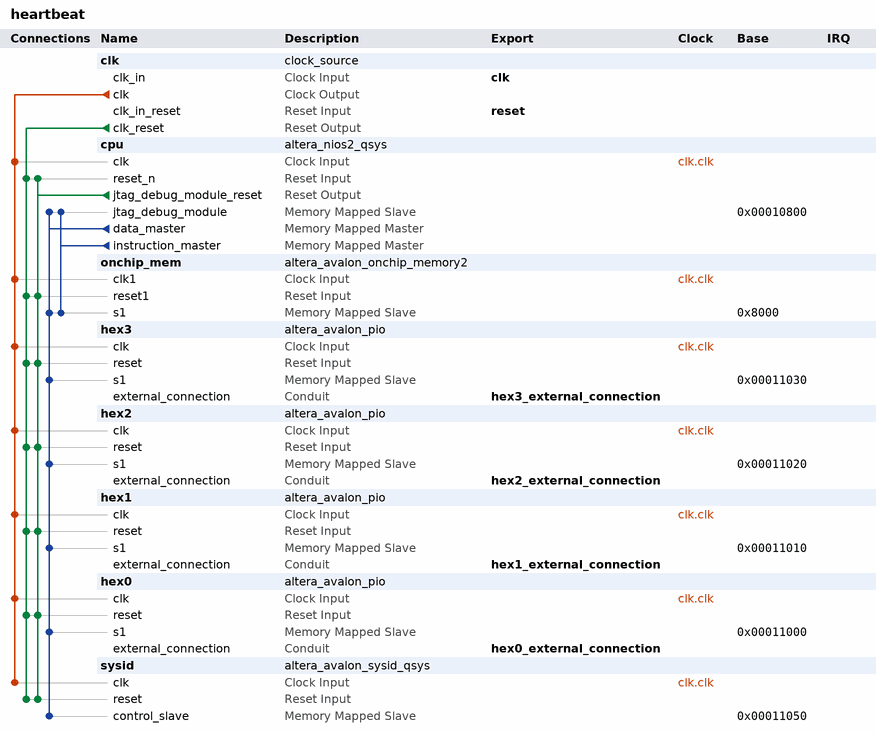
[diagram p0: system contents]
# Platform Designer (Qsys) system heartbeat, Cyclone II EP2C20F484C7
# Parameters at their usual value, and those the tool derives, are not listed.
package require -exact qsys 13.0.1.99.2
create_system heartbeat
set_project_property DEVICE_FAMILY {Cyclone II}
set_project_property DEVICE EP2C20F484C7

add_instance clk clock_source 13.0
set_instance_parameter_value clk clockFrequency 50000000

add_instance cpu altera_nios2_qsys 13.0
set_instance_parameter_value cpu resetSlave onchip_mem.s1
set_instance_parameter_value cpu mmu_TLBMissExcSlave None
set_instance_parameter_value cpu exceptionSlave onchip_mem.s1
set_instance_parameter_value cpu breakSlave cpu.jtag_debug_module
set_instance_parameter_value cpu impl Tiny
set_instance_parameter_value cpu icache_size 4096

add_instance onchip_mem altera_avalon_onchip_memory2 13.0.1.99.2
set_instance_parameter_value onchip_mem dataWidth 32
set_instance_parameter_value onchip_mem dualPort false
set_instance_parameter_value onchip_mem initMemContent true
set_instance_parameter_value onchip_mem initializationFileName onchip_mem.hex
set_instance_parameter_value onchip_mem memorySize 20000

add_instance hex3 altera_avalon_pio 13.0.1.99.2
set_instance_parameter_value hex3 direction Output
set_instance_parameter_value hex3 width 7

add_instance hex2 altera_avalon_pio 13.0.1.99.2
set_instance_parameter_value hex2 direction Output
set_instance_parameter_value hex2 width 7

add_instance hex1 altera_avalon_pio 13.0.1.99.2
set_instance_parameter_value hex1 direction Output
set_instance_parameter_value hex1 width 7

add_instance hex0 altera_avalon_pio 13.0.1.99.2
set_instance_parameter_value hex0 direction Output
set_instance_parameter_value hex0 width 7

add_instance sysid altera_avalon_sysid_qsys 13.0
set_instance_parameter_value sysid id 0

# connections
add_connection clk.clk cpu.clk clock
add_connection clk.clk hex0.clk clock
add_connection clk.clk hex1.clk clock
add_connection clk.clk hex2.clk clock
add_connection clk.clk hex3.clk clock
add_connection clk.clk onchip_mem.clk1 clock
add_connection clk.clk sysid.clk clock
add_connection clk.clk_reset cpu.reset_n reset
add_connection clk.clk_reset hex0.reset reset
add_connection clk.clk_reset hex1.reset reset
add_connection clk.clk_reset hex2.reset reset
add_connection clk.clk_reset hex3.reset reset
add_connection clk.clk_reset onchip_mem.reset1 reset
add_connection clk.clk_reset sysid.reset reset
add_connection cpu.jtag_debug_module_reset cpu.reset_n reset
add_connection cpu.jtag_debug_module_reset hex0.reset reset
add_connection cpu.jtag_debug_module_reset hex1.reset reset
add_connection cpu.jtag_debug_module_reset hex2.reset reset
add_connection cpu.jtag_debug_module_reset hex3.reset reset
add_connection cpu.jtag_debug_module_reset onchip_mem.reset1 reset
add_connection cpu.jtag_debug_module_reset sysid.reset reset
add_connection cpu.data_master cpu.jtag_debug_module avalon
set_connection_parameter_value cpu.data_master/cpu.jtag_debug_module baseAddress 0x00010800
add_connection cpu.data_master hex0.s1 avalon
set_connection_parameter_value cpu.data_master/hex0.s1 baseAddress 0x00011000
add_connection cpu.data_master hex1.s1 avalon
set_connection_parameter_value cpu.data_master/hex1.s1 baseAddress 0x00011010
add_connection cpu.data_master hex2.s1 avalon
set_connection_parameter_value cpu.data_master/hex2.s1 baseAddress 0x00011020
add_connection cpu.data_master hex3.s1 avalon
set_connection_parameter_value cpu.data_master/hex3.s1 baseAddress 0x00011030
add_connection cpu.data_master onchip_mem.s1 avalon
set_connection_parameter_value cpu.data_master/onchip_mem.s1 baseAddress 0x8000
add_connection cpu.data_master sysid.control_slave avalon
set_connection_parameter_value cpu.data_master/sysid.control_slave baseAddress 0x00011050
add_connection cpu.instruction_master cpu.jtag_debug_module avalon
set_connection_parameter_value cpu.instruction_master/cpu.jtag_debug_module baseAddress 0x00010800
add_connection cpu.instruction_master onchip_mem.s1 avalon
set_connection_parameter_value cpu.instruction_master/onchip_mem.s1 baseAddress 0x8000

# exported interfaces
add_interface clk clock sink
set_interface_property clk EXPORT_OF clk.clk_in
add_interface reset reset sink
set_interface_property reset EXPORT_OF clk.clk_in_reset
add_interface hex3_external_connection conduit end
set_interface_property hex3_external_connection EXPORT_OF hex3.external_connection
add_interface hex2_external_connection conduit end
set_interface_property hex2_external_connection EXPORT_OF hex2.external_connection
add_interface hex1_external_connection conduit end
set_interface_property hex1_external_connection EXPORT_OF hex1.external_connection
add_interface hex0_external_connection conduit end
set_interface_property hex0_external_connection EXPORT_OF hex0.external_connection

set_interconnect_requirement {$system} qsys_mm.clockCrossingAdapter HANDSHAKE
set_interconnect_requirement {$system} qsys_mm.maxAdditionalLatency 1

save_system heartbeat.qsys
